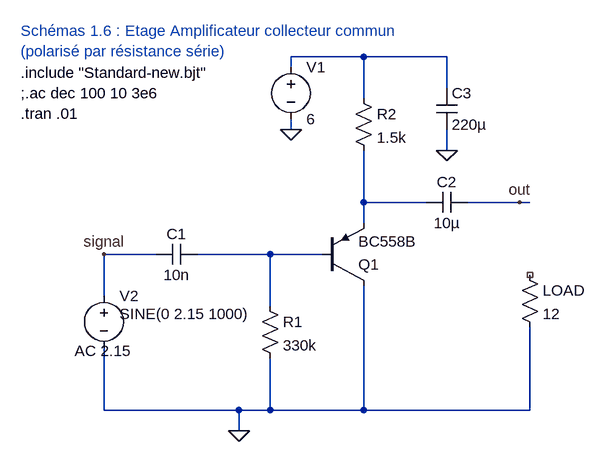
[diagram p0: schematic 1_6-AmpliCollecteurCommun.asc]
1_6-AmpliCollecteurCommun.asc, the LTspice schematic file:
Version 4
SHEET 1 1436 808
WIRE 880 64 768 64
WIRE 1008 64 880 64
WIRE 768 80 768 64
WIRE 1008 112 1008 64
WIRE 880 128 880 64
WIRE 768 176 768 160
WIRE 1008 208 1008 176
WIRE 880 288 880 208
WIRE 976 288 880 288
WIRE 1120 288 1040 288
WIRE 1136 288 1120 288
WIRE 880 320 880 288
WIRE 560 368 480 368
WIRE 736 368 624 368
WIRE 816 368 736 368
WIRE 480 432 480 368
WIRE 736 448 736 368
WIRE 480 608 480 512
WIRE 688 608 480 608
WIRE 736 608 736 528
WIRE 736 608 688 608
WIRE 880 608 880 416
WIRE 880 608 736 608
WIRE 1136 608 1136 480
WIRE 1136 608 880 608
WIRE 688 640 688 608
FLAG 768 176 0
FLAG 688 640 0
FLAG 1120 288 out
FLAG 480 368 signal
FLAG 1008 208 0
SYMBOL voltage 768 64 R0
WINDOW 123 0 0 Left 0
WINDOW 39 0 0 Left 0
SYMATTR InstName V1
SYMATTR Value 6
SYMBOL voltage 480 416 R0
WINDOW 123 -45 101 Left 2
WINDOW 39 0 0 Left 0
WINDOW 3 24 44 Left 2
SYMATTR Value2 AC 2.15
SYMATTR Value SINE(0 2.15 1000)
SYMATTR InstName V2
SYMBOL res 864 112 R0
SYMATTR InstName R2
SYMATTR Value 1.5k
SYMBOL cap 624 352 R90
WINDOW 0 0 32 VBottom 2
WINDOW 3 32 32 VTop 2
SYMATTR InstName C1
SYMATTR Value 10n
SYMBOL cap 976 304 R270
WINDOW 0 32 32 VTop 2
WINDOW 3 0 32 VBottom 2
SYMATTR InstName C2
SYMATTR Value 10µ
SYMBOL res 720 432 R0
SYMATTR InstName R1
SYMATTR Value 330k
SYMBOL cap 992 112 R0
SYMATTR InstName C3
SYMATTR Value 220µ
SYMATTR SpiceLine V=10
SYMBOL res 1120 384 R0
SYMATTR InstName LOAD
SYMATTR Value 12
SYMBOL pnp 816 416 M180
SYMATTR InstName Q1
SYMATTR Value BC558B
TEXT 352 24 Left 2 ;Schémas 1.6 : Etage Amplificateur collecteur commun\n(polarisé par résistance série)
TEXT 352 120 Left 2 !;.ac dec 100 10 3e6\n.tran .01
TEXT 352 88 Left 2 !.include "Standard-new.bjt"

The netlist it stands for:
* 1_6-AmpliCollecteurCommun.asc
V1 N001 0 6
V2 signal 0 SINE(0 2.15 1000) AC 2.15
R2 N001 N002 1.5k
C1 N003 signal 10n
C2 N002 out 10µ
R1 N003 0 330k
C3 N001 0 220µ V=10
R§LOAD NC_01 0 12
Q1 0 N003 N002 0 BC558B
.model NPN NPN
.model PNP PNP
.lib standard.bjt
* Schémas 1.6 : Etage Amplificateur collecteur commun
* (polarisé par résistance série)
;.ac dec 100 10 3e6
.tran .01
.include "Standard-new.bjt"
.backanno
.end